# Altium schematic sheet Sheet1.SchDoc
size A4
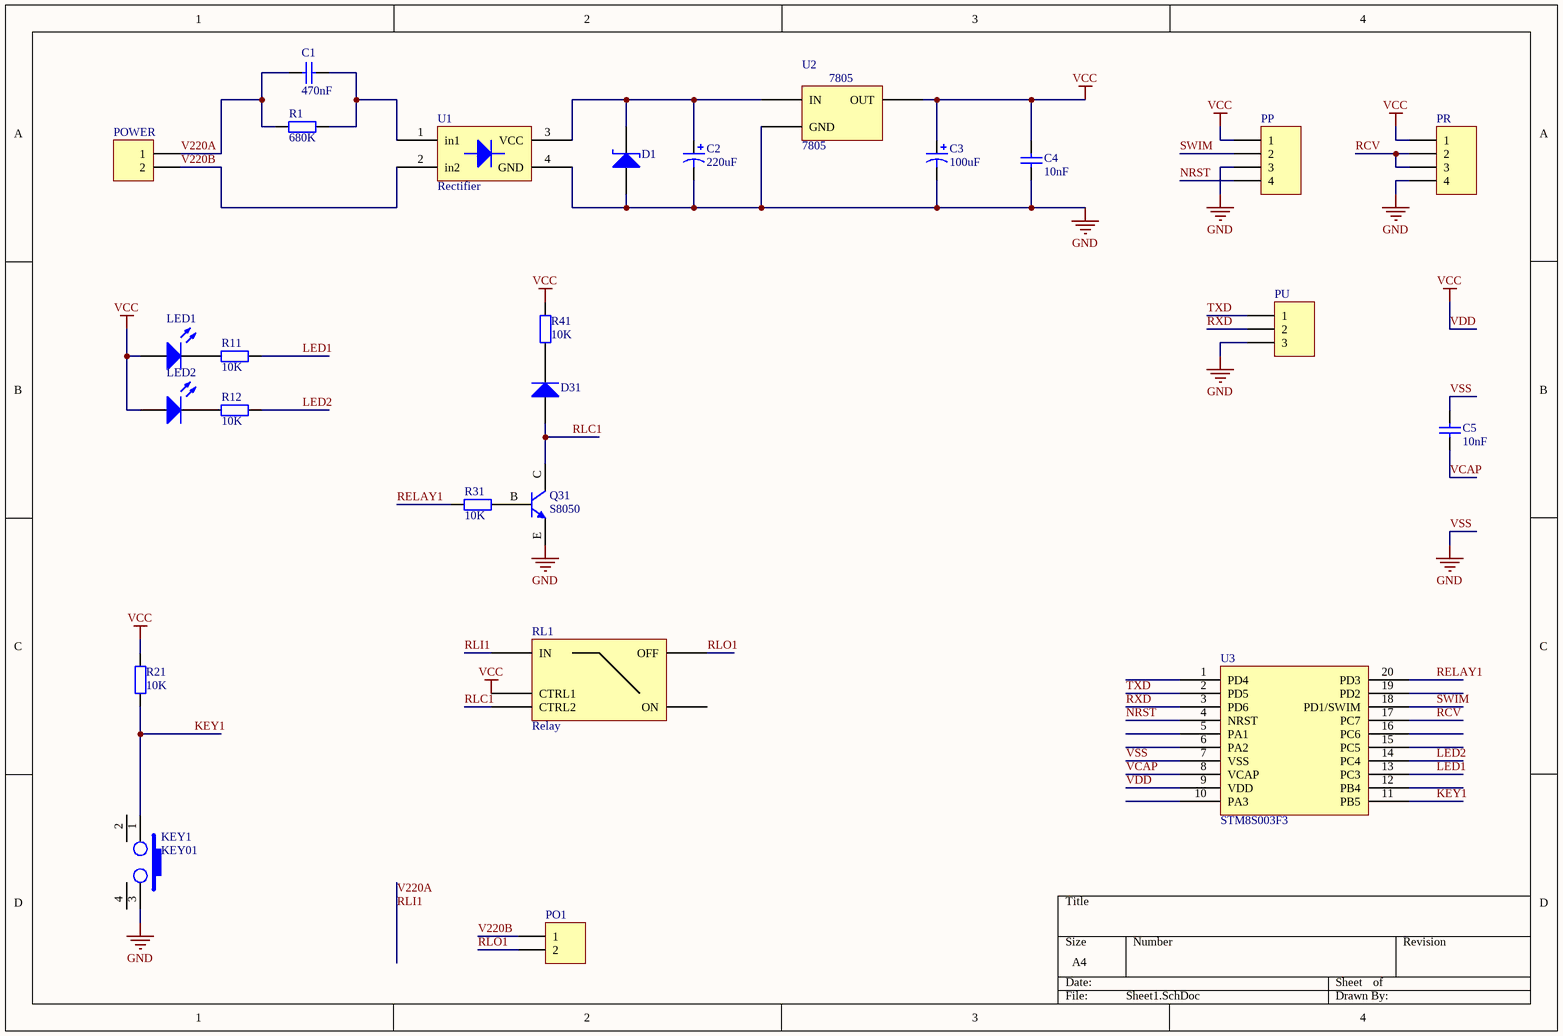
[diagram p0: Sheet1.SchDoc]

## Parts
C1  value 470nF  [Cap3]  (hidden comment: Cap)
C2  value 220uF  [CAP1.25]  (hidden comment: Cap Pol2)
C3  value 100uF  [CAP1]  (hidden comment: Cap Pol2)
C4  value 10nF  [0805]  (hidden comment: Cap)
C5  value 10nF  [0805]  (hidden comment: Cap)
D1  Diode_S  [Dinode3]  (value not drawn)
D31  Diode  [DINODE]  (value not drawn)
KEY1  KEY01  [Key_v]
LED1  LED1  [LED]  (value not drawn)
LED2  LED1  [LED]  (value not drawn)
PO1  Header 2  [KF301-2P]  (value not drawn)
POWER  Header 2  [KF301-2P]  (value not drawn)
PP  Header 4  [HDR1X4]  (value not drawn)
PR  Header 4  [HDR1X4]  (value not drawn)
PU  Header 3  [HDR1X3]  (value not drawn)
Q31  S8050  [SOT23]
R1  value 680K  [0805]  (hidden comment: Res)
R11  value 10K  [0805]  (hidden comment: Res)
R12  value 10K  [0805]  (hidden comment: Res)
R21  value 10K  [0805]  (hidden comment: Res)
R31  value 10K  [0805]  (hidden comment: Res)
R41  value 10K  [0805]  (hidden comment: Res)
RL1  Relay  [Relay_SRS]
U1  Rectifier  [MB6S]
U2  7805  [TO-92A]
U3  STM8S003F3  [SSOP20]

## Nets
VDD: C3.1 C4.2 LED1.A LED2.A PP.1 PR.1 R21.2 R41.2 RL1.3(CTRL1) U2.1(OUT) U3.9(VDD)  [also labelled VCC]
VSS: C2.2 C3.2 C4.1 C5.2 D1.A KEY1.3 PP.3 PR.4 PU.3 Q31.E U1.4(GND) U2.2(GND) U3.7(VSS)  [also labelled GND]
KEY1: KEY1.1 R21.1 U3.11(PB5)
LED1: R11.1 U3.13(PC3)
LED2: R12.1 U3.14(PC4)
NRST: PP.4 U3.4(NRST)
RCV: PR.2 PR.3 U3.17(PC7)
RELAY1: R31.2 U3.20(PD3)
RLC1: D31.A Q31.C RL1.4(CTRL2)
RLI1: C1.1 POWER.1 R1.1 RL1.5(IN)  [also labelled V220A]
RLO1: PO1.2 RL1.1(OFF)
RXD: PU.2 U3.3(PD6)
SWIM: PP.2 U3.18(PD1/SWIM)
TXD: PU.1 U3.2(PD5)
V220B: PO1.1 POWER.2 U1.2(in2)
VCAP: C5.1 U3.8(VCAP)
NetC1_2: C1.2 R1.2 U1.1(in1)
NetC2_1: C2.1 D1.K U1.3(VCC) U2.3(IN)
NetD31_K: D31.K R41.1
NetLED1_K: LED1.K R11.2
NetLED2_K: LED2.K R12.2
NetQ31_B: Q31.B R31.1

Not connected (* = marked no-connect by the designer): KEY1 2 4; RL1 2(ON); U3 1(PD4) 5(PA1) 6(PA2) 10(PA3) 12(PB4) 15(PC5) 16(PC6) 19(PD2)

## Library data of the parts
C1 C4 C5 = Cap: Capacitor; Published: 8-Jun-2000; PackageReference: RAD-0.3; Publisher: Altium Limited; PackageDescription: Radial Cap, Thru-Hole; 2 Leads; 0.3 in Pin Spacing
C2 C3 = Cap Pol2: Polarized Capacitor (Axial); Published: 8-Jun-2000; PackageReference: POLAR0.8; Publisher: Altium Limited
D1 = Diode_S: Default Diode; Published: 8-Jun-2000; PackageReference: SMC; Publisher: Altium Limited
D31 = Diode: Default Diode; Published: 8-Jun-2000; PackageReference: SMC; Publisher: Altium Limited
KEY1 = KEY
LED1 LED2 = LED1: Typical RED GaAs LED; Published: 8-Jun-2000; PackageReference: LED-1; Publisher: Altium Limited
PO1 POWER = Header 2: Header, 2-Pin; Publisher: Altium Limited
PP PR = Header 4: Header, 4-Pin; Publisher: Altium Limited
PU = Header 3: Header, 3-Pin; LatestRevisionDate: 17-Jul-2002; LatestRevisionNote: Re-released for DXP Platform.; Publisher: Altium Limited
Q31 = S8050: NPN General Purpose Amplifier; Published: 8-Jun-2000; PackageReference: TO-92A; Publisher: Altium Limited
R1 R11 R12 R21 R31 R41 = Res: Resistor; Published: 8-Jun-2000; PackageReference: AXIAL-0.4; Publisher: Altium Limited